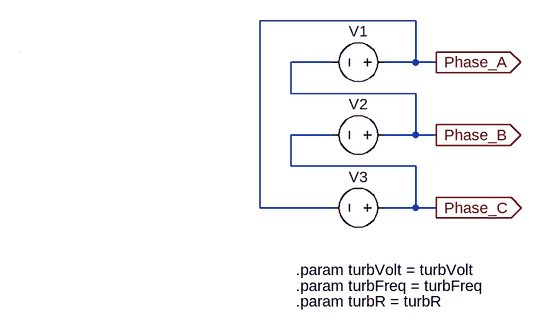
[diagram p0: schematic 3phgen.asc]
3phgen.asc, the LTspice schematic file:
Version 4
SHEET 1 880 680
WIRE 608 -48 368 -48
WIRE 480 16 416 16
WIRE 608 16 608 -48
WIRE 608 16 560 16
WIRE 640 16 608 16
WIRE 416 64 416 16
WIRE 608 64 416 64
WIRE 480 128 416 128
WIRE 608 128 608 64
WIRE 608 128 560 128
WIRE 640 128 608 128
WIRE 416 176 416 128
WIRE 608 176 416 176
WIRE 368 240 368 -48
WIRE 480 240 368 240
WIRE 608 240 608 176
WIRE 608 240 560 240
WIRE 640 240 608 240
WIRE 0 0 0 0
FLAG 640 16 Phase_A
IOPIN 640 16 Out
FLAG 640 128 Phase_B
IOPIN 640 128 Out
FLAG 640 240 Phase_C
IOPIN 640 240 Out
SYMBOL voltage 576 16 R90
WINDOW 0 -32 56 VBottom 2
WINDOW 3 32 56 Invisible 2
WINDOW 123 0 0 Left 0
SYMATTR InstName V1
SYMATTR Value SINE(0 {turbVolt} {turbFreq} 0 0 0)
SYMATTR SpiceLine Rser={turbR}
SYMBOL voltage 576 128 R90
WINDOW 0 -32 56 VBottom 2
WINDOW 3 32 56 Invisible 2
WINDOW 123 0 0 Left 0
SYMATTR InstName V2
SYMATTR Value SINE(0 {turbVolt} {turbFreq} 0 0 120)
SYMATTR SpiceLine Rser={turbR}
SYMBOL voltage 576 240 R90
WINDOW 0 -32 56 VBottom 2
WINDOW 3 32 56 Invisible 2
WINDOW 123 0 0 Left 0
SYMATTR InstName V3
SYMATTR Value SINE(0 {turbVolt} {turbFreq} 0 0 240)
SYMATTR SpiceLine Rser={turbR}
TEXT 424 336 Left 2 !.param turbVolt = turbVolt
TEXT 424 360 Left 2 !.param turbFreq = turbFreq
TEXT 424 384 Left 2 !.param turbR = turbR

The netlist it stands for:
* 3phgen.asc
V1 Phase_A Phase_B SINE(0 {turbVolt} {turbFreq} 0 0 0) Rser={turbR}
V2 Phase_B Phase_C SINE(0 {turbVolt} {turbFreq} 0 0 120) Rser={turbR}
V3 Phase_C Phase_A SINE(0 {turbVolt} {turbFreq} 0 0 240) Rser={turbR}
.param turbVolt = turbVolt
.param turbFreq = turbFreq
.param turbR = turbR
.backanno
.end